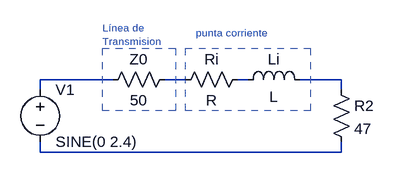
[diagram p0: schematic esqPuntaCorriente.asc]
esqPuntaCorriente.asc, the LTspice schematic file:
Version 4
SHEET 1 880 680
WIRE 144 96 32 96
WIRE 256 96 224 96
WIRE 352 96 336 96
WIRE 496 96 432 96
WIRE 32 112 32 96
WIRE 496 112 496 96
WIRE 32 208 32 192
WIRE 496 208 496 192
WIRE 496 208 32 208
SYMBOL voltage 32 96 R0
WINDOW 123 0 0 Left 2
WINDOW 39 0 0 Left 2
SYMATTR InstName V1
SYMATTR Value SINE(0 2.4)
SYMBOL res 128 112 R270
WINDOW 0 32 56 VTop 2
WINDOW 3 0 56 VBottom 2
SYMATTR InstName Z0
SYMATTR Value 50
SYMBOL res 480 96 R0
SYMATTR InstName R2
SYMATTR Value 47
SYMBOL res 240 112 R270
WINDOW 0 32 56 VTop 2
WINDOW 3 0 56 VBottom 2
SYMATTR InstName Ri
SYMBOL ind 336 112 R270
WINDOW 0 32 56 VTop 2
WINDOW 3 5 56 VBottom 2
SYMATTR InstName Li
TEXT 128 16 Left 1 ;Línea de\nTransmision
TEXT 272 24 Left 1 ;punta corriente
LINE Normal 128 144 128 48 2
LINE Normal 240 144 128 144 2
LINE Normal 240 48 240 144 2
LINE Normal 128 48 240 48 2
LINE Normal 256 144 256 48 2
LINE Normal 448 144 256 144 2
LINE Normal 448 48 448 144 2
LINE Normal 256 48 448 48 2

The netlist it stands for:
* esqPuntaCorriente.asc
V1 N001 N005 SINE(0 2.4)
R§Z0 N001 N002 50
R2 N004 N005 47
Ri N002 N003 R
Li N003 N004 L
* Línea de
* Transmision
* punta corriente
.backanno
.end